# Altium project CurlingStone.PrjPcb
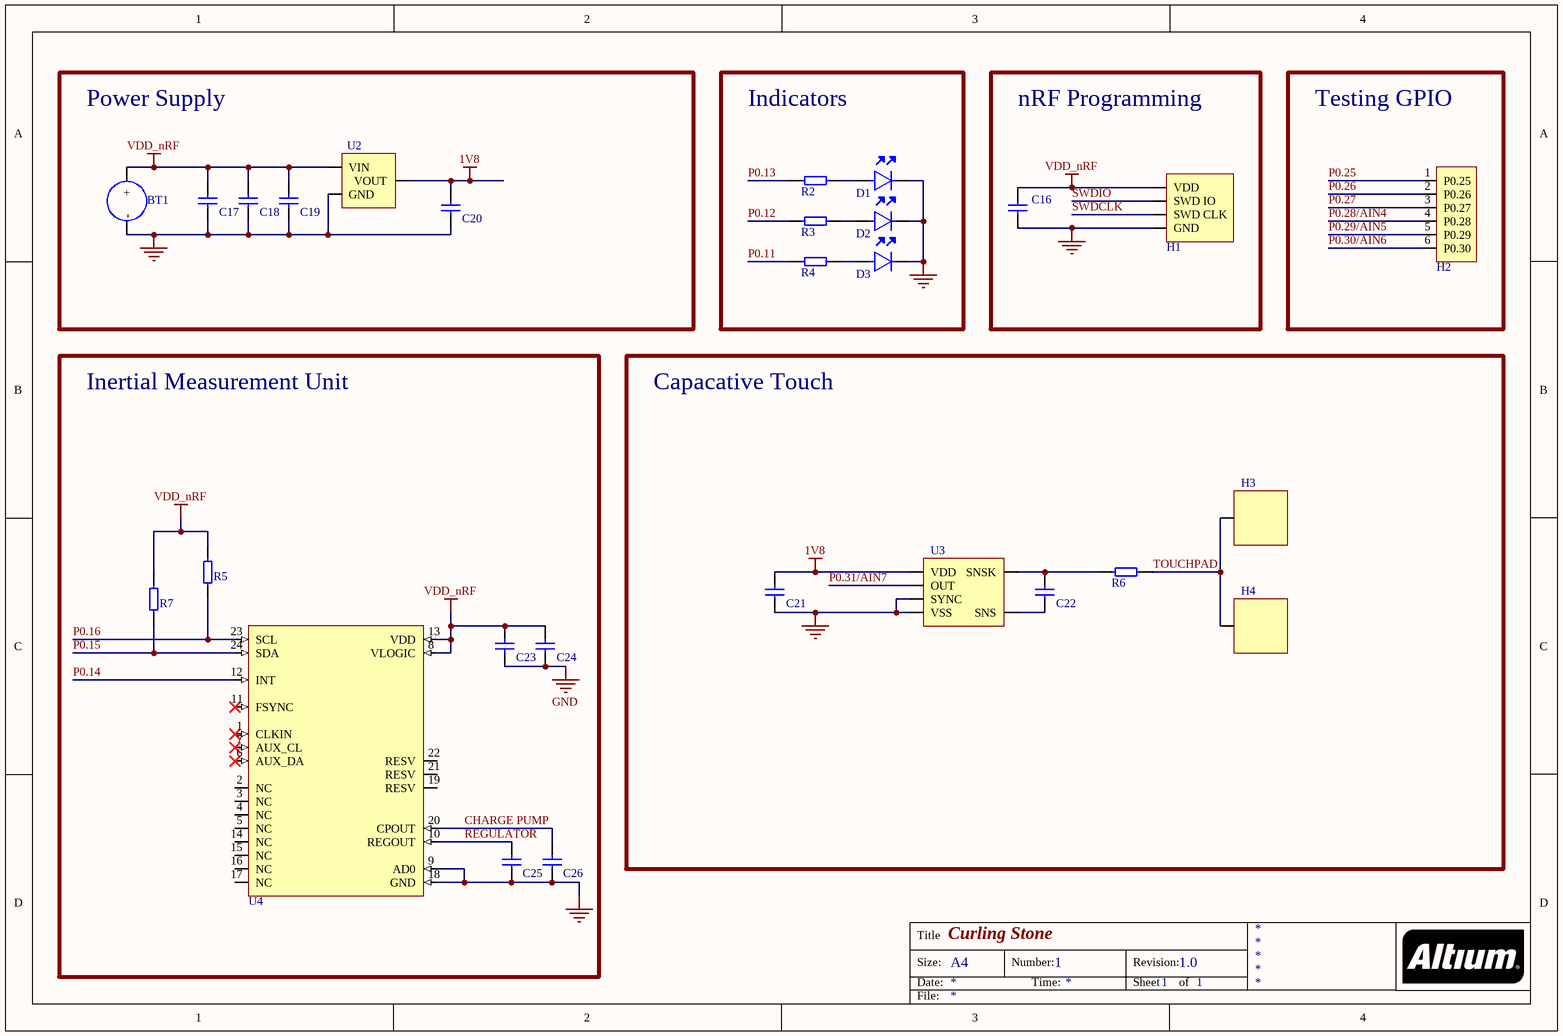
[diagram p0: CurlingStoneSchematic.SchDoc]
2 sheets, 50 parts. Net scope: global (net labels, ports and power ports of the same name join across sheets).
Board file: nrf52832_qfax_dcdc.PcbDoc
Sheets:
  CurlingStoneSchematic.SchDoc
  nrf52832_qfab_dcdc.SchDoc

## Sheet CurlingStoneSchematic.SchDoc: Curling Stone
size A4; Author: Martin Moldsvor; DocumentNumber: 1; Revision: 1.0; SheetNumber: 1; SheetTotal: 1

### Parts
BT1  Battery Holder  [Battery Holder]  (value not drawn)
C16  0603 Capacitor  [0603]  (value not drawn)
C17  0603 Capacitor  [0603]  (value not drawn)
C18  0603 Capacitor  [0603]  (value not drawn)
C19  0603 Capacitor  [0603]  (value not drawn)
C20  0603 Capacitor  [0603]  (value not drawn)
C21  0603 Capacitor  [0603]  (value not drawn)
C22  0603 Capacitor  [0603]  (value not drawn)
C23  0603 Capacitor  [0603]  (value not drawn)
C24  0603 Capacitor  [0603]  (value not drawn)
C25  0603 Capacitor  [0603]  (value not drawn)
C26  0603 Capacitor  [0603]  (value not drawn)
D1  0603 LED  [0603 LED]  (value not drawn)
D2  0603 LED  [0603 LED]  (value not drawn)
D3  0603 LED  [0603 LED]  (value not drawn)
H1  4x1 Header  [4x1 HEADER TH]  (value not drawn)
H2  6x1 Header  [6x1 HEADER TH]  (value not drawn)
H3  Electrode  [ELECTRODE EXTERNAL]  (value not drawn)
H4  Electrode  [ELECTRODE INTERNAL]  (value not drawn)
R2  0603 Resistor  [0603]  (value not drawn)
R3  0603 Resistor  [0603]  (value not drawn)
R4  0603 Resistor  [0603]  (value not drawn)
R5  0603 Resistor  [0603]  (value not drawn)
R6  0603 Resistor  [0603]  (value not drawn)
R7  0603 Resistor  [0603]  (value not drawn)
U2  MCP1700 1V8  [MCP1700 SOT-23]  (value not drawn)
U3  Capacative Touch  [CAPACATIVE TOUCH]  (value not drawn)
U4  MPU-6050  [MPU-6050]  (value not drawn)

### Blocks framed on the sheet
Power Supply: BT1 C17-C20 U2
Indicators: D1-D3 R2-R4
nRF Programming: C16 H1
Testing GPIO: H2
Inertial Measurement Unit: C23-C26 R5 R7 U4
Capacative Touch: C21 C22 H3 H4 R6 U3

### Nets
1V8: C20.2 C21.2 U2.2(VOUT) U3.5(VDD)
GND: BT1.2(-) C16.1 C17.1 C18.1 C19.1 C20.1 C21.1 C23.1 C24.1 C25.1 C26.1 D1.2 D2.2 D3.2 H1.2(GND) U2.1(GND) U3.2(VSS) U3.6(SYNC) U4.9(AD0) U4.18(GND)
VDD_nRF: BT1.1(+) C16.2 C17.2 C18.2 C19.2 C23.2 C24.2 H1.1(VDD) R5.2 R7.2 U2.3(VIN) U4.8(VLOGIC) U4.13(VDD)
CHARGE PUMP: C26.2 U4.20(CPOUT)
P0.11: R4.1
P0.12: R3.1
P0.13: R2.1
P0.14: U4.12(INT)
P0.15: R7.1 U4.24(SDA)
P0.16: R5.1 U4.23(SCL)
P0.25: H2.1(P0.25)
P0.26: H2.2(P0.26)
P0.27: H2.3(P0.27)
P0.28/AIN4: H2.4(P0.28)
P0.29/AIN5: H2.5(P0.29)
P0.30/AIN6: H2.6(P0.30)
P0.31/AIN7: U3.1(OUT)
REGULATOR: C25.2 U4.10(REGOUT)
SWDCLK: H1.3(SWD_CLK)
SWDIO: H1.4(SWD_IO)
TOUCHPAD: H3.1(GND) H4.1(GND) R6.2
NetC22_1: C22.1 U3.4(SNS)
NetC22_2: C22.2 R6.1 U3.3(SNSK)
NetD1_1: D1.1 R2.2
NetD2_1: D2.1 R3.2
NetD3_1: D3.1 R4.2

Not connected (* = marked no-connect by the designer): U4 1(CLKIN)* 2(NC) 3(NC) 4(NC) 5(NC) 6(AUX_DA)* 7(AUX_CL)* 11(FSYNC)* 14(NC) 15(NC) 16(NC) 17(NC) 19(RESV) 21(RESV) 22(RESV)

### Notes on the sheet
- Title
- Size:
- Date:
- A4
- Number:
- Time:
- Revision:
- Sheet
- of
- File:

### Library data of the parts
BT1 = Battery Holder: Battery Holder 1-Cell 20mm Size Tin Nickel SMT Mount T/R; Manufacturer 1: Keystone Electronics; Manufacturer Part Number 1: 3034TR; Number of Batteries: 1; Supplier 1: Digi-Key; Supplier Part Number 1: 36-3034CT-ND; RoHS: Yes; Category: Uncategorized; Stock 1: 74655; Pricing 1: 1=0.42000, 25=0.37760, 100=0.28630, 250=0.25592 (USD); Mount: Surface Mount,PCB; Case/Package: SMD/SMT; Material: Bronze; Contact Plating: Tin; Termination: SMD/SMT; Packaging: Tape and Reel; Package Quantity: 500; Number of Cells: 1; Lead Free: Lead Free; ComponentLink1URL: https://datasheet.ciiva.com/29204/3034tr-29204080.pdf?src-supplier=Digi-Key; ComponentLink1Description: https://datasheet.ciiva.com/29204/3034tr-29204080.pdf?src-supplier=Digi-Key; ComponentLink2URL: https://datasheet.ciiva.com/41797/3034-41797079.pdf?src-supplier=Digi-Key; ComponentLink2Description: https://datasheet.ciiva.com/41797/3034-41797079.pdf?src-supplier=Digi-Key
D1-D3 = 0603 LED: LED Uni-Color Green 574nm 2-Pin Chip LED T/R; Manufacturer 1: Vishay Lite-On; Manufacturer Part Number 1: LTST-C191KGKT; Lens Color: Colorless; Power Rating: 75mW; Luminous Intensity: 35mcd; Viewing Angle: 130°; Lens Style: Rectangular,Colorless; Forward Current: 30mA; Forward Voltage: 2V; Dominant Wavelength: 571nm; Test Current: 20mA; Lens Transparency: Clear; Number of Elements: 1; Reverse Voltage: 5V; Supplier 1: Digi-Key; Supplier Part Number 1: 160-1446-1-ND; RoHS: Yes; Category: LEDs; Pricing 1: 1=0.26000, 10=0.14100, 100=0.06560, 500=0.06060, 1000=0.04747, 2000=0.04646 (USD); Mount: Surface Mount; Case/Package: 0603; Number of Pins: 2; Color: Green; Case Code (Metric): 1608; Case Code (Imperial): 0603; Min Operating Temperature: -55°C; Max Operating Temperature: 85°C; Packaging: Tape and Reel; Package Quantity: 1; Illumination Color: Green; Power Dissipation: 75mW; Wavelength: 574nm; Number of LEDs: 1; Max Power Dissipation: 75mW; Length: 1.6mm; Width: 0.8mm; Height: 0.55mm; Depth: 0.8mm; Radiation Hardening: No; Lead Free: Lead Free; RoHS Compliant: Yes; ComponentLink1URL: https://datasheet.ciiva.com/2109/ltst-c191kgkt-2109973.pdf?src-supplier=Digi-Key; ComponentLink1Description: https://datasheet.ciiva.com/2109/ltst-c191kgkt-2109973.pdf?src-supplier=Digi-Key
U2 = MCP1700 1V8: V REG, LDO 250MA, SMD, SOT-23-3; Output Voltage:1.8V; Dropout voltage:0.178V; No. of Pins:3; Voltage Regulator IC Case Style:SOT-23; Operating Temperature Range:-40°C to +125°C; Case Style:SOT-23; Max Operating Temperature:125°C; Min;RoHS Compliant: Yes; Manufacturer 1: Microchip; Manufacturer Part Number 1: MCP1700T-1802E/TT; Nominal Output Voltage: 1.8V; Min Input Voltage: 2.3V; Max Input Voltage: 6V; Dropout Voltage: 150mV; Number of Outputs: 1; Max Power Dissipation: 369.6mW; Input Bias Current: 1.6uA; Quiescent Current: 4uA; Polarity: Positive; Accuracy: 2%; Output Type: Fixed; Supplier 1: Digi-Key; Supplier Part Number 1: MCP1700T1802ETTCT-ND; RoHS: Yes; Category: Voltage Regulators - Linear; Stock 1: 24907; Pricing 1: 1=0.39000, 25=0.33000, 100=0.29000 (USD); Mount: Surface Mount; Case/Package: SOT-23; Number of Pins: 3; Min Operating Temperature: -40°C; Max Operating Temperature: 125°C; Packaging: Tape and Reel; Output Current: 250mA; Max Output Current: 250mA; Output Voltage: 1.8V; Max Supply Voltage: 6V; Min Supply Voltage: 2.3V; Package Quantity: 3000; Min Output Voltage: 1.8V; Max Output Voltage: 1.8V; Termination: SMD/SMT; Output Voltage Accuracy: 2%; Nominal Supply Current: 4uA; Power Dissipation: 369.6mW; Supply Current: 4uA; Length: 2.9mm; Width: 1.3mm; Height: 0.95mm; Radiation Hardening: No; REACH SVHC: No SVHC; Lead Free: Lead Free; RoHS Compliant: Yes; ComponentLink1URL: https://datasheet.ciiva.com/14150/mcp1700-eng-tds-14150117.pdf?src-supplier=Distrelec; ComponentLink1Description: https://datasheet.ciiva.com/14150/mcp1700-eng-tds-14150117.pdf?src-supplier=Distrelec; ComponentLink2URL: https://datasheet.ciiva.com/17364/jp011779-17364282.pdf?src-supplier=Avnet+Europe; ComponentLink2Description: https://datasheet.ciiva.com/17364/jp011779-17364282.pdf?src-supplier=Avnet+Europe; ComponentLink3URL: https://datasheet.ciiva.com/2040/21826b-2040109.pdf?src-supplier=Digi-Key; ComponentLink3Description: https://datasheet.ciiva.com/2040/21826b-2040109.pdf?src-supplier=Digi-Key; ComponentLink4URL: https://datasheet.ciiva.com/8041/21826b-8041597.pdf?src-supplier=Element14; ComponentLink4Description: https://datasheet.ciiva.com/8041/21826b-8041597.pdf?src-supplier=Element14; ComponentLink5URL: https://datasheet.ciiva.com/2040/21826b-2040110.pdf?src-supplier=Digi-Key; ComponentLink5Description: https://datasheet.ciiva.com/2040/21826b-2040110.pdf?src-supplier=Digi-Key; ComponentLink6URL: https://datasheet.ciiva.com/8237/jp011779-8237326.pdf?src-supplier=Avnet; ComponentLink6Description: https://datasheet.ciiva.com/8237/jp011779-8237326.pdf?src-supplier=Avnet; ComponentLink7URL: https://datasheet.ciiva.com/16218/filehandler-aspxddocname-en011779-16218350.pdf?src-supplier=Future+Electronics; ComponentLink7Description: https://datasheet.ciiva.com/16218/filehandler-aspxddocname-en011779-16218350.pdf?src-supplier=Future+Electronics
U3 = Capacative Touch: Capacitive Touch Screen 1Keys 6-Pin SOT-23 Tape and Reel; Manufacturer 1: Microchip / Atmel; Manufacturer Part Number 1: AT42QT1011-TSHR; Number of Inputs: 1; Resolution: 14b; Operating Supply Current: 378.5uA; Min Supply Voltage: 1.8V; Max Supply Voltage: 5.5V; Load Capacitance: 50pF; Nominal Supply Current: 729uA; Supplier 1: Digi-Key; Supplier Part Number 1: AT42QT1011-TSHRCT-ND; RoHS: Yes; Category: Uncategorized; Pricing 1: 1=0.61000, 25=0.56000, 100=0.50000 (USD); Mount: Surface Mount; Case/Package: SOT-23-6; Number of Pins: 6; Min Operating Temperature: -40°C; Max Operating Temperature: 85°C; Packaging: Tape and Reel; Package Quantity: 4500; Number of Channels: 1; Touchscreen: Capacitive; Series: QTouch™; Supply Current: 729uA; Length: 3mm; Width: 1.75mm; Height: 1.3mm; RoHS Compliant: Yes; REACH SVHC: No SVHC; Lead Free: Lead Free; ComponentLink1URL: https://datasheet.ciiva.com/1165/731627-1165685.pdf?src-supplier=Element14; ComponentLink1Description: https://datasheet.ciiva.com/1165/731627-1165685.pdf?src-supplier=Element14; ComponentLink2URL: https://datasheet.ciiva.com/14094/at42qt1011-eng-tds-14094872.pdf?src-supplier=Distrelec; ComponentLink2Description: https://datasheet.ciiva.com/14094/at42qt1011-eng-tds-14094872.pdf?src-supplier=Distrelec; ComponentLink3URL: https://datasheet.ciiva.com/1403/doc8287-1403456.pdf?src-supplier=Digi-Key; ComponentLink3Description: https://datasheet.ciiva.com/1403/doc8287-1403456.pdf?src-supplier=Digi-Key; ComponentLink4URL: https://datasheet.ciiva.com/1403/doc8287-1403457.pdf?src-supplier=Digi-Key; ComponentLink4Description: https://datasheet.ciiva.com/1403/doc8287-1403457.pdf?src-supplier=Digi-Key; ComponentLink5URL: https://datasheet.ciiva.com/1403/doc8287-1403458.pdf?src-supplier=Digi-Key; ComponentLink5Description: https://datasheet.ciiva.com/1403/doc8287-1403458.pdf?src-supplier=Digi-Key; ComponentLink6URL: https://datasheet.ciiva.com/15222/getdatasheetpartid-463081-15222284.pdf?src-supplier=Verical; ComponentLink6Description: https://datasheet.ciiva.com/15222/getdatasheetpartid-463081-15222284.pdf?src-supplier=Verical
U4 = MPU-6050: INVENSENSE   MPU-6050   GYRO / ACCEL, 6-AXIS, I2C, QFN-24; Manufacturer 1: TDK InvenSense; Sensor Type: Accelerometer,Gyroscope,3 Axis; Supplier 1: Digi-Key; Supplier Part Number 1: 1428-1007-1-ND; Manufacturer Part Number 1: MPU-6050; RoHS: Yes; Category: Inertial Measurement Units (IMUs); Stock 1: 3318; Pricing 1: 1=7.55000, 5=6.62400, 10=5.96200, 25=5.30000, 50=4.90240, 100=4.24000, 500=3.97500, 1000=3.71000 (USD); Mount: Surface Mount; Case/Package: QFN; Min Operating Temperature: -40°C; Max Operating Temperature: 85°C; Packaging: Tape and Reel; Output Type: I2C; Series: -; RoHS Compliant: Yes; ComponentLink1URL: https://datasheet.ciiva.com/1513/1788002-1513632.pdf?src-supplier=Element14; ComponentLink1Description: https://datasheet.ciiva.com/1513/1788002-1513632.pdf?src-supplier=Element14; ComponentLink2URL: https://datasheet.ciiva.com/22731/1788002-22731434.pdf?src-supplier=Element14; ComponentLink2Description: https://datasheet.ciiva.com/22731/1788002-22731434.pdf?src-supplier=Element14

## Sheet nrf52832_qfab_dcdc.SchDoc: nRF52832-QFAB Reference Layout (DCDC)
size A4; Revision: 1.1; SheetNumber: 1; SheetTotal: 1; DrawnBy: RUBR/KJP; DocumentSize: A4; PCAName: nRF52832-QFAB Reference Layout (DCDC)
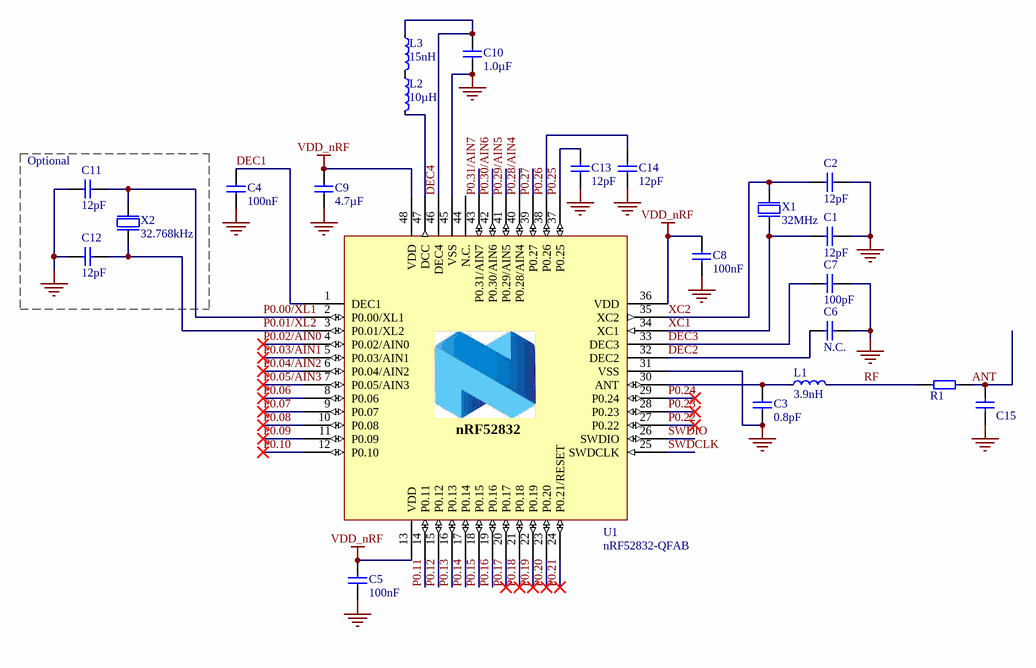
[diagram p1: nrf52832_qfab_dcdc.SchDoc]

### Parts
C1  12pF  [CAPC1005X04L]
C2  12pF  [CAPC1005X04L]
C3  0.8pF  [CAPC1005X04L]
C4  100nF  [CAPC1005X04L]
C5  100nF  [CAPC1005X04L]
C6  N.C.  [CAPC1005X04L]
C7  100pF  [CAPC1005X04L]
C8  100nF  [CAPC1005X04L]
C9  4.7µF  [CAPC1608X06L]
C10  1.0µF  [CAPC1608X06L]
C11  12pF  [CAPC1005X04L]
C12  12pF  [CAPC1005X04L]
C13  12pF  [CAPC1005X04L]
C14  12pF  [CAPC1005X04L]
C15  0603 Capacitor  [RF_0603]  (value not drawn)
L1  3.9nH  [INDC1005X04L]
L2  10µH  [INDC1608X06L]
L3  15nH  [INDC1005X04L]
R1  0603 Resistor  [RF_0603]  (value not drawn)
U1  nRF52832-QFAB  [QFN40P600X600X90-48N]
X1  32MHz  [BT-XTAL_2016]
X2  32.768kHz  [XTAL_3215]

### Blocks framed on the sheet
Optional: C11 C12 X2

### Nets
GND: C1.2 C2.2 C3.1 C4.2 C5.2 C6.1 C7.2 C8.2 C9.2 C10.1 C11.2 C12.2 C13.2 C14.2 C15.1 U1.31(VSS) U1.45(VSS) U1.49(GND) X1.2(GND) X1.4(GND)
VDD_nRF: C5.1 C8.1 C9.1 U1.13(VDD) U1.36(VDD) U1.48(VDD)
ANT: C15.2 R1.2
DEC1: C4.1 U1.1(DEC1)
DEC2: C6.2 U1.32(DEC2)
DEC3: C7.1 U1.33(DEC3)
DEC4: C10.2 L3.1 U1.46(DEC4)
P0.00/XL1: C11.1 U1.2(P0.00/XL1) X2.1(inp)
P0.01/XL2: C12.1 U1.3(P0.01/XL2) X2.2(out)
P0.02/AIN0: U1.4(P0.02/AIN0)
P0.03/AIN1: U1.5(P0.03/AIN1)
P0.04/AIN2: U1.6(P0.04/AIN2)
P0.05/AIN3: U1.7(P0.05/AIN3)
P0.06: U1.8(P0.06)
P0.07: U1.9(P0.07)
P0.08: U1.10(P0.08)
P0.09: U1.11(P0.09)
P0.10: U1.12(P0.10)
P0.11: U1.14(P0.11)
P0.12: U1.15(P0.12)
P0.13: U1.16(P0.13)
P0.14: U1.17(P0.14)
P0.15: U1.18(P0.15)
P0.16: U1.19(P0.16)
P0.17: U1.20(P0.17)
P0.18: U1.21(P0.18)
P0.19: U1.22(P0.19)
P0.20: U1.23(P0.20)
P0.21: U1.24(P0.21/RESET)
P0.22: U1.27(P0.22)
P0.23: U1.28(P0.23)
P0.24: U1.29(P0.24)
P0.25: C13.1 U1.37(P0.25)
P0.26: C14.1 U1.38(P0.26)
P0.27: U1.39(P0.27)
P0.28/AIN4: U1.40(P0.28/AIN4)
P0.29/AIN5: U1.41(P0.29/AIN5)
P0.30/AIN6: U1.42(P0.30/AIN6)
P0.31/AIN7: U1.43(P0.31/AIN7)
RF: L1.2 R1.1
SWDCLK: U1.25(SWDCLK)
SWDIO: U1.26(SWDIO)
XC1: C1.1 U1.34(XC1) X1.1(inp)
XC2: C2.1 U1.35(XC2) X1.3(out)
NetC3_2: C3.2 L1.1 U1.30(ANT)
NetL2_1: L2.1 L3.2
NetL2_2: L2.2 U1.47(DCC)

Not connected (* = marked no-connect by the designer): U1 44(N.C.)

### Notes on the sheet
- Title
- Size
- Date:
- Project Number
- Sheet         of
- Revision
- File:
- Drawn By:
- (in symbol nRF52832-QFAB) nRF52832

### Library data of the parts
C1 C2 C11-C14 = C0402-12p: Capacitor, NP0, ±2%; Note: 50V; Artikkelnr Noca: 20029159; Artikkelnr Simpro: N.A.; Part Number: C0402-12p; Manufacturer: *; Manufacturer Part Number: *; Datasheet: *; LatestRevisionDate: 2011-05-11; Pin Count: 2; Publisher: Nordic Semiconductor; Published: 2009-05-08; Value: 12pF; Supplier: *; Supplier part number: *; 2nd source Supplier: *; 2nd source part number: *; Footprint Doc: 0402
C3 = C0402-0.8p: Capacitor, NP0, ±5%; Note: 50V; Artikkelnr Noca: 20029147; Artikkelnr Simpro: N.A.; Part Number: C0402-0.8p; Manufacturer: *; Manufacturer Part Number: *; Datasheet: *; LatestRevisionDate: 2012-11-21; Pin Count: 2; Publisher: Nordic Semiconductor; Published: 2009-05-08; Value: 0.8pF; Supplier: *; Supplier part number: *; 2nd source Supplier: *; 2nd source part number: *; Footprint Doc: 0402
C4 C5 C8 = C0402-100n: Capacitor, X7R, ±10%; Note: 16V; Artikkelnr Noca: 20039200; Artikkelnr Simpro: N.A.; Part Number: C0402-100n; Manufacturer: *; Manufacturer Part Number: *; Datasheet: *; LatestRevisionDate: 2009-11-23; Pin Count: 2; Publisher: Nordic Semiconductor; Published: 2009-05-08; Value: 100nF; Supplier: *; Supplier part number: *; 2nd source Supplier: *; 2nd source part number: *; Footprint Doc: 0402
C6 = C0402-N.C.: Not mounted; Note: Chip Cap; Artikkelnr Noca: N.A.; Part Number: C0402-N.C.; Manufacturer: *; Manufacturer Part Number: *; Datasheet: *; LatestRevisionDate: 2009-05-08; Pin Count: 2; Publisher: Nordic Semiconductor; Published: 2009-05-08; Value: N.C.; Supplier: *; Supplier part number: *; 2nd source Supplier: *; 2nd source part number: *; Footprint Doc: 0402; Artikkelnr Simpro: N.A.
C7 = C0402-100p: Capacitor, NP0, ±5%; Note: 50V; Artikkelnr Noca: 20029135; Artikkelnr Simpro: N.A.; Part Number: C0402-100p; Manufacturer: *; Manufacturer Part Number: *; Datasheet: *; LatestRevisionDate: 2009-05-08; Pin Count: 2; Publisher: Nordic Semiconductor; Published: 2009-05-08; Value: 100pF; Supplier: *; Supplier part number: *; 2nd source Supplier: *; 2nd source part number: *; Footprint Doc: 0402
C9 = C0603-4µ7: Capacitor, X5R, ±10%; Note: 6.3V; Artikkelnr Noca: 20069060; Artikkelnr Simpro: N.A.; Part Number: C0603-4µ7; Manufacturer: *; Manufacturer Part Number: *; Datasheet: *; LatestRevisionDate: 2009-11-23; Pin Count: 2; Publisher: Nordic Semiconductor; Published: 2009-05-08; Value: 4.7µF; Supplier: *; Supplier part number: *; 2nd source Supplier: *; 2nd source part number: *; Footprint Doc: 0603
C10 = C0603-1µ0: Capacitor, X7R, ±10%; Note: 16V; Artikkelnr Noca: 20039335; Artikkelnr Simpro: N.A.; Part Number: C0603-1µ0; Manufacturer: *; Manufacturer Part Number: *; Datasheet: *; LatestRevisionDate: 2013-06-05; Pin Count: 2; Publisher: Nordic Semiconductor; Published: 2009-05-08; Value: 1.0µF; Supplier: *; Supplier part number: *; 2nd source Supplier: *; 2nd source part number: *; Footprint Doc: 0603
L1 = L0402-3n9: High frequency chip inductor ±5%; Manufacturer: Murata; Manufacturer Part Number: LQP15MN3N9B02D; Artikkelnr Noca: 33029151; Artikkelnr Simpro: N.A.; Part Number: L0402-3n9; Datasheet: http://search.murata.co.jp/Ceramy/image/img/PDF/ENG/L0075S0084LQP15M.pdf; LatestRevisionDate: 2012-09-19; Pin Count: 2; Publisher: Nordic Semiconductor; Published: 2009-05-08; Value: 3.9nH; Note: High frequency chip inductor ±5%; Supplier: Digi-Key; Supplier part number: 490-1131-1-ND; 2nd source Supplier: *; 2nd source part number: *; Footprint Doc: 0402
L2 = L0603-10µ: Chip inductor, IDC,min = 50 mA, ±20%; Manufacturer: Taiyo Yuden; Manufacturer Part Number: LBMF1608T100K; 2nd source part number: 178-6105; Note: LBMF1608T100K 10µH 80mA 0603; Artikkelnr Noca: 33029314; Artikkelnr Simpro: N.A.; Part Number: L0603-10µ; Datasheet: http://www.yuden.co.jp/ut/product/pdf/elb2_e.pdf; LatestRevisionDate: 2012-09-19; Pin Count: 2; Publisher: Nordic Semiconductor; Published: 2010-02-24; Value: 10µH; Supplier: Digi-Key; Supplier part number: 587-1714-1-ND; 2nd source Supplier: Farnell; Footprint Doc: 0603
L3 = L0402-15n: High frequency chip inductor ±10%; Manufacturer: Taiyo Yuden; Manufacturer Part Number: HK100515NJ-T; 2nd source part number: 658-1328; Artikkelnr Noca: 33029323; Artikkelnr Simpro: N.A.; Part Number: L0402-15n; LatestRevisionDate: 2012-09-19; Pin Count: 2; Publisher: Nordic Semiconductor; Published: 2010-07-12; Value: 15nH; Note: High frequency chip inductor ±10%; Supplier: Digi-Key; Datasheet: http://www.yuden.co.jp/productdata/catalog/en/mlci04_e.pdf; Supplier part number: 587-1521-1-ND; 2nd source Supplier: Farnell; Footprint Doc: 0402
U1 = nRF52832-QFAB: Multi-protocol Bluetooth Low Energy, ANT and 2.4GHz proprietary system-on-chip; Manufacturer: Nordic Semiconductor; Artikkelnr Noca: N.A.; Part Number: nRF52832-QFAB; Manufacturer Part Number: nRF52832-QFAB; Datasheet: *; LatestRevisionDate: 2016-11-24; Pin Count: 48; Publisher: Nordic Semiconductor; Published: 2016-11-24; Value: nRF52832-QFAB; Note: *; Supplier: Nordic Semiconductor; Supplier part number: *; 2nd source Supplier: *; 2nd source part number: *; Footprint Doc: QFN-48; Artikkelnr Simpro: N.A.
X1 = XTAL_SMD2016_32MHz_8pF_General: XTAL SMD 2016, 32MHz, Cl=8pF, Total Tol: ±40ppm; Note: XTAL SMD 32.000MHz; Artikkelnr Noca: N.A.; Part Number: XTAL_SMD2016_32MHz_8pF_General; Manufacturer: *; Manufacturer Part Number: *; Datasheet: *; LatestRevisionDate: 2016-08-19; Pin Count: 4; Publisher: Nordic Semiconductor; Published: 2016-08-19; Value: 32MHz; Supplier: *; Supplier part number: *; 2nd source Supplier: *; 2nd source part number: *; Footprint Doc: XTAL_2016; Artikkelnr Simpro: N.A.
X2 = XTAL_SMD3215_32.768kHz_9pF_General: XTAL SMD 3215, 32.768kHz, Cl=9pF, Total Tol: ±50ppm; Note: XTAL SMD 32.768kHz; Artikkelnr Noca: N.A.; Part Number: XTAL_SMD3215_32.768kHz_9pF_General; Manufacturer: *; Manufacturer Part Number: *; Datasheet: *; LatestRevisionDate: 2016-08-19; Pin Count: 2; Publisher: Nordic Semiconductor; Published: 2016-08-19; Value: 32.768kHz; Supplier: *; Supplier part number: *; 2nd source Supplier: *; 2nd source part number: *; Footprint Doc: XTAL_3215; Artikkelnr Simpro: N.A.

## Nets that join several sheets
GND: CurlingStoneSchematic (20 pins), nrf52832_qfab_dcdc (20 pins)
VDD_nRF: CurlingStoneSchematic (13 pins), nrf52832_qfab_dcdc (6 pins)
P0.11: CurlingStoneSchematic (R4.1), nrf52832_qfab_dcdc (U1.14)
P0.12: CurlingStoneSchematic (R3.1), nrf52832_qfab_dcdc (U1.15)
P0.13: CurlingStoneSchematic (R2.1), nrf52832_qfab_dcdc (U1.16)
P0.14: CurlingStoneSchematic (U4.12), nrf52832_qfab_dcdc (U1.17)
P0.15: CurlingStoneSchematic (R7.1 U4.24), nrf52832_qfab_dcdc (U1.18)
P0.16: CurlingStoneSchematic (R5.1 U4.23), nrf52832_qfab_dcdc (U1.19)
P0.25: CurlingStoneSchematic (H2.1), nrf52832_qfab_dcdc (C13.1 U1.37)
P0.26: CurlingStoneSchematic (H2.2), nrf52832_qfab_dcdc (C14.1 U1.38)
P0.27: CurlingStoneSchematic (H2.3), nrf52832_qfab_dcdc (U1.39)
P0.28/AIN4: CurlingStoneSchematic (H2.4), nrf52832_qfab_dcdc (U1.40)
P0.29/AIN5: CurlingStoneSchematic (H2.5), nrf52832_qfab_dcdc (U1.41)
P0.30/AIN6: CurlingStoneSchematic (H2.6), nrf52832_qfab_dcdc (U1.42)
P0.31/AIN7: CurlingStoneSchematic (U3.1), nrf52832_qfab_dcdc (U1.43)
SWDCLK: CurlingStoneSchematic (H1.3), nrf52832_qfab_dcdc (U1.25)
SWDIO: CurlingStoneSchematic (H1.4), nrf52832_qfab_dcdc (U1.26)